# Altium schematic sheet FCC0603B103K500CT.schdoc
size 127 x 101 mm
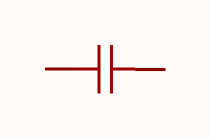
[diagram p0: FCC0603B103K500CT.schdoc]

## Parts
C?  fcc0603b103k500ct  [C0603]  (value not drawn)

## Nets

Not connected (* = marked no-connect by the designer): C? 1 2

## Library data of the parts
C? = fcc0603b103k500ct: 容值:10nF;精度:±10%;额定电压:50V;温度系数:X7R;; Manufacturer: FOJAN(富捷); AddInBom: yes; ModelId: ac125912035d415993ca9572d50418b1; ModelName: C0603_L1.6-W0.8-H0.8; ModelTransform: 62.992,31.496,0,0,0,0,0,0,0; Value: 10nF; Tolerance: ±10%; Voltage Rating: 50V; Temperature Coefficient: X7R; Symbol: FCC0603B103K500CT; LCSC Part Name: 10nF ±10% 50V; SupplierPart: C5137477; ManufacturerPart: FCC0603B103K500CT; Supplier Footprint: 0603; JLCPCB Part Class: Extended Part; Datasheet: https://item.szlcsc.com/datasheet/FCC0603B103K500CT/5746979.html; Supplier: LCSC; ConvertToPcb: yes; FootprintName: C0603; Operating Temperature: -55℃~+125℃